# EasyEDA schematic SCH_sawtooth-using-BJT_2024-02-24.json
TITLE: Sheet_1; REV: 1.0; Date: 2024-02-17; Sheet: 1/1; Company: Your Company
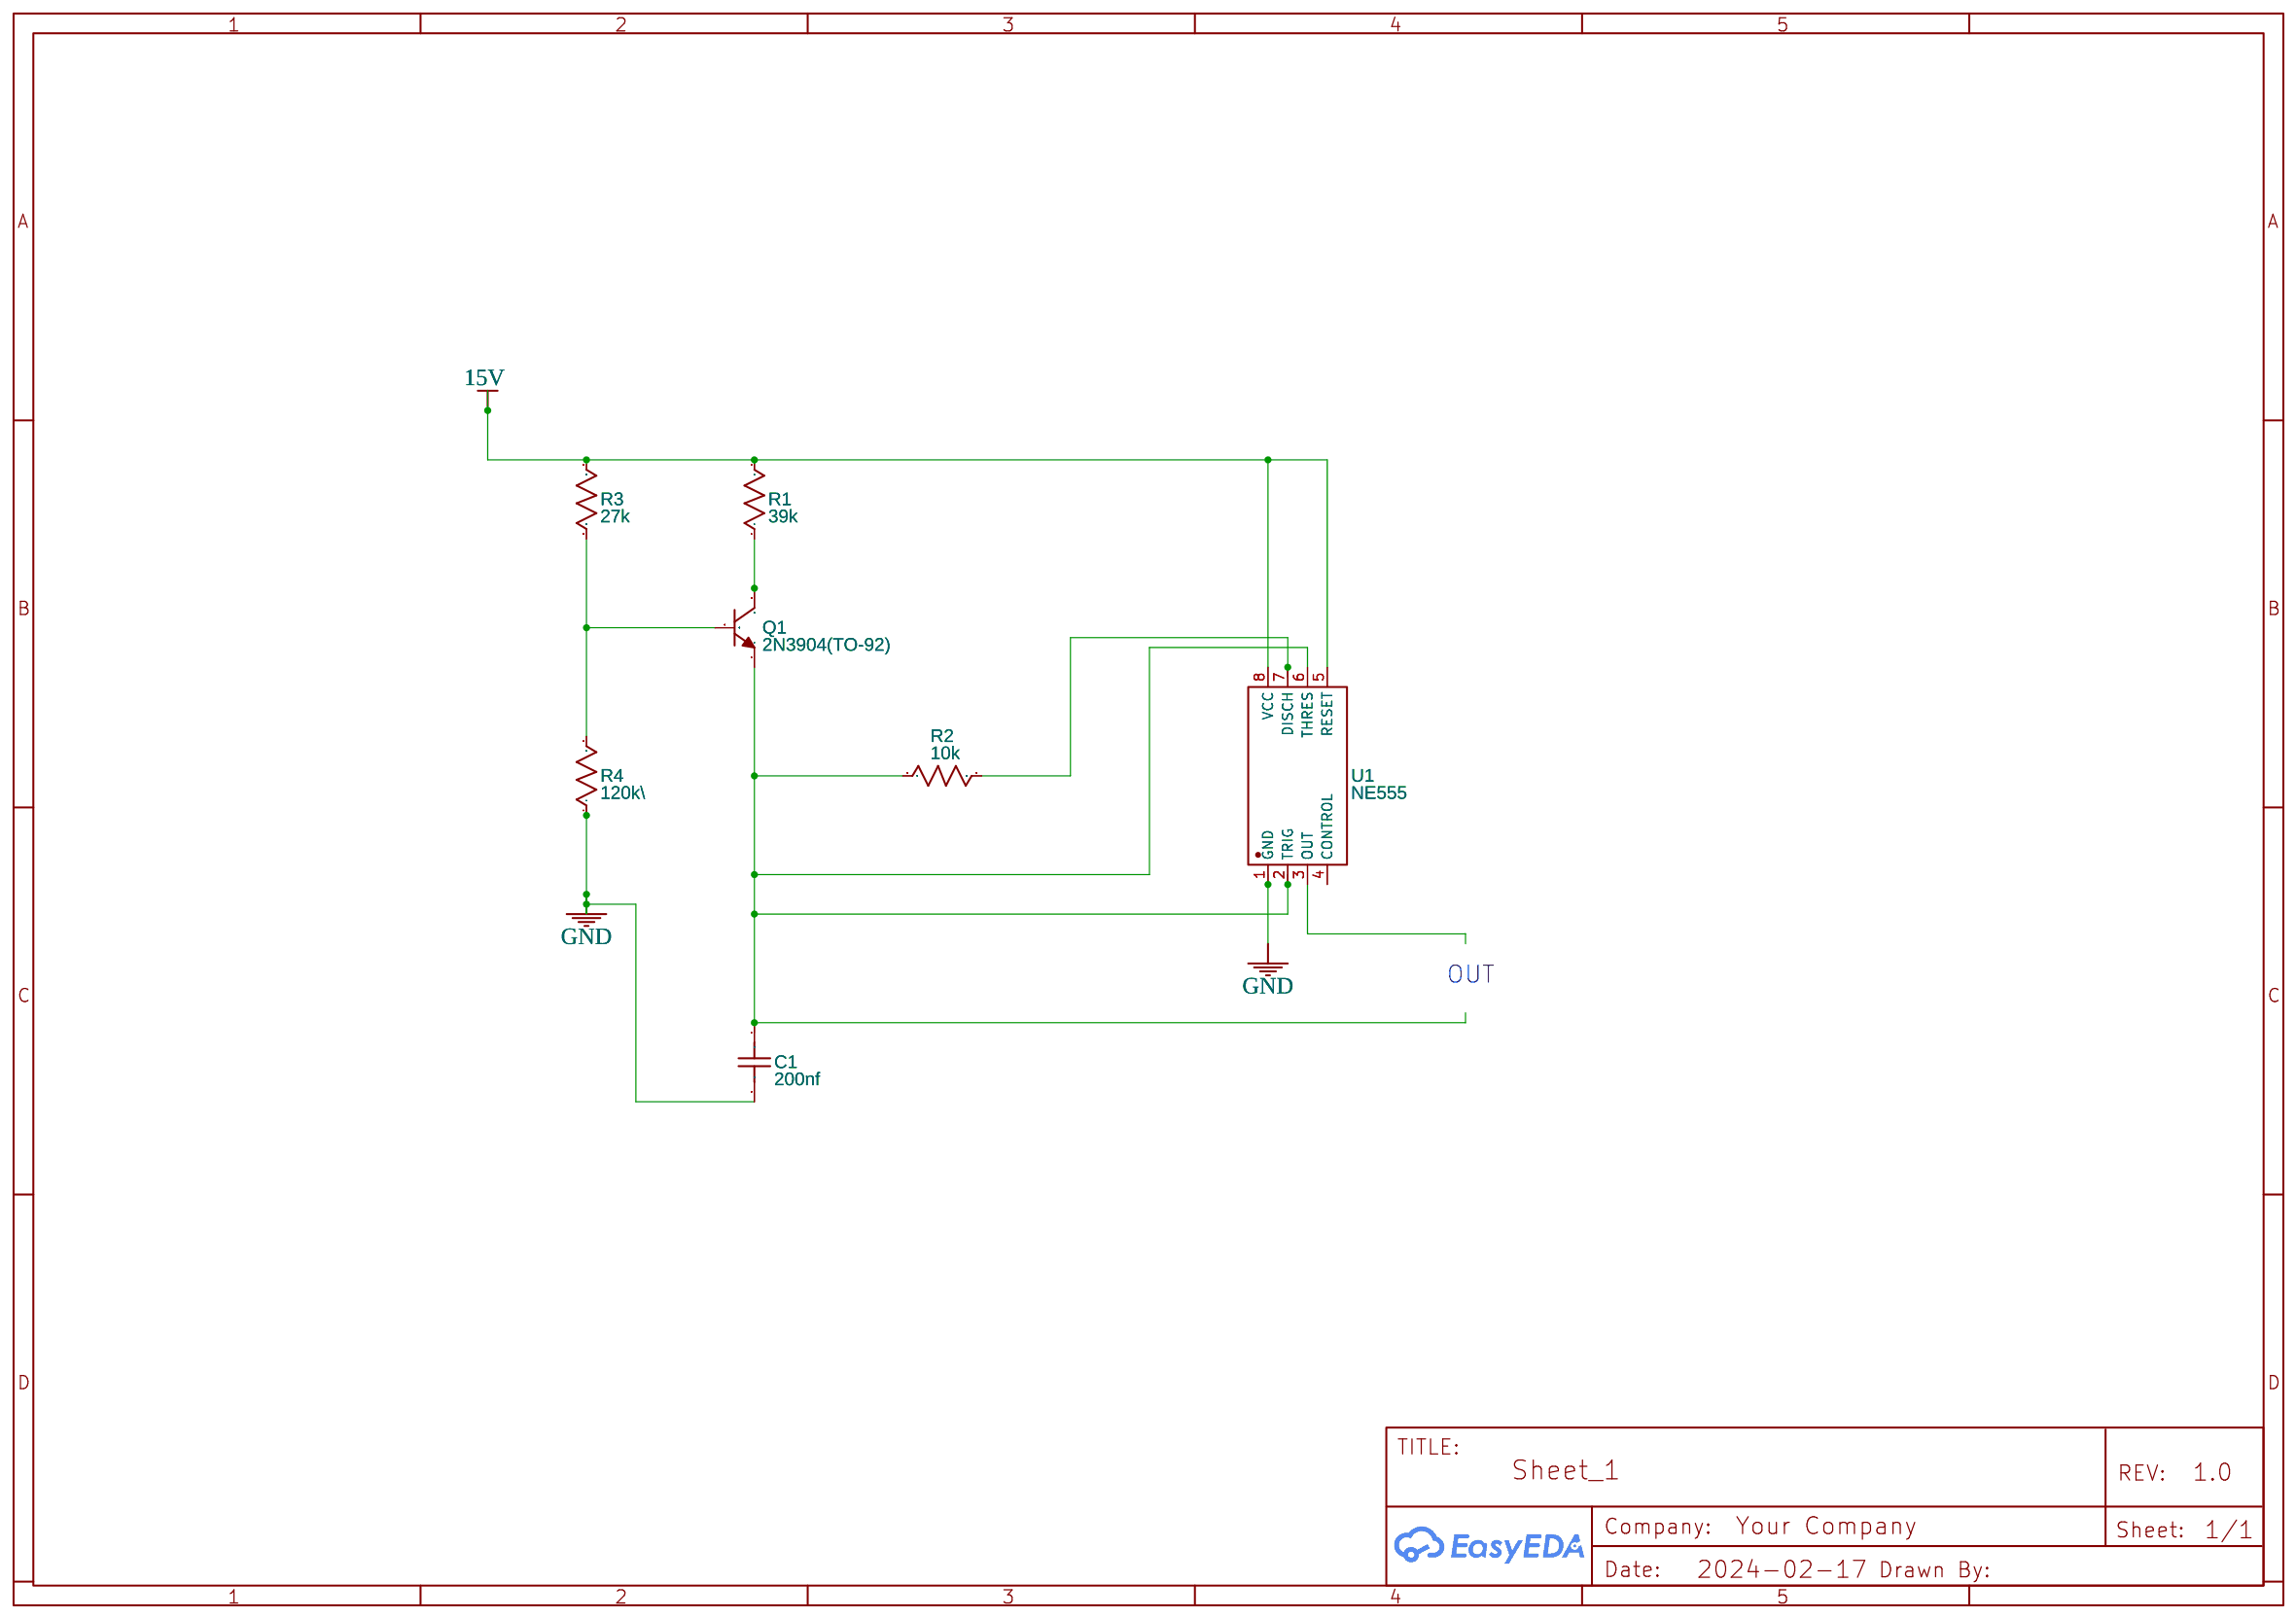
[diagram p0: schematic sheet]

## Parts
C1  200nf  [C0603]
Q1  2N3904(TO-92)  [TO-92-3_L5.1-W4.1-P1.27-L]
R1  39k  [R0603]
R2  10k  [R0603]
R3  27k  [R0603]
R4  120k\  [R0603]
U1  NE555  [SOP-8_L5.0-W4.0-P1.27-LS6.0-BL]

## Library data of the parts
C1 = C_0603_US: Contributor: LCEDA_Lib
Q1 = 2N3904(TO-92): Supplier: LCSC; Manufacturer: SEMTECH; Manufacturer Part: 2N3904; Supplier Part: C118538; Contributor: LCEDA_Lib
R1-R4 = R_0603_US: Contributor: LCEDA_Lib
U1 = NE555: Contributor: LCSC; Supplier: LCSC; Supplier Part: C504549; Manufacturer: null; JLCPCB Part Class: Extended Part

## Nets
15V: R1.2 R3.2 U1.5(RESET) U1.8(VCC)
GND: C1.2 R4.1 U1.1(GND)
Net-(C1-1): C1.1 Q1.1(E) R2.1 U1.2(TRIG) U1.6(THRES)
Net-(Q1-2): Q1.2(B) R3.1 R4.2
Net-(Q1-3): Q1.3(C) R1.1
Net-(R2-2): R2.2 U1.7(DISCH)

Not connected (* = marked no-connect by the designer): U1 3(OUT) 4(CONTROL)

## Notes on the sheet
- OUT
